# EAGLE design SparkFun_AS3935_Lightning_Detector (EAGLE 9.4.0)
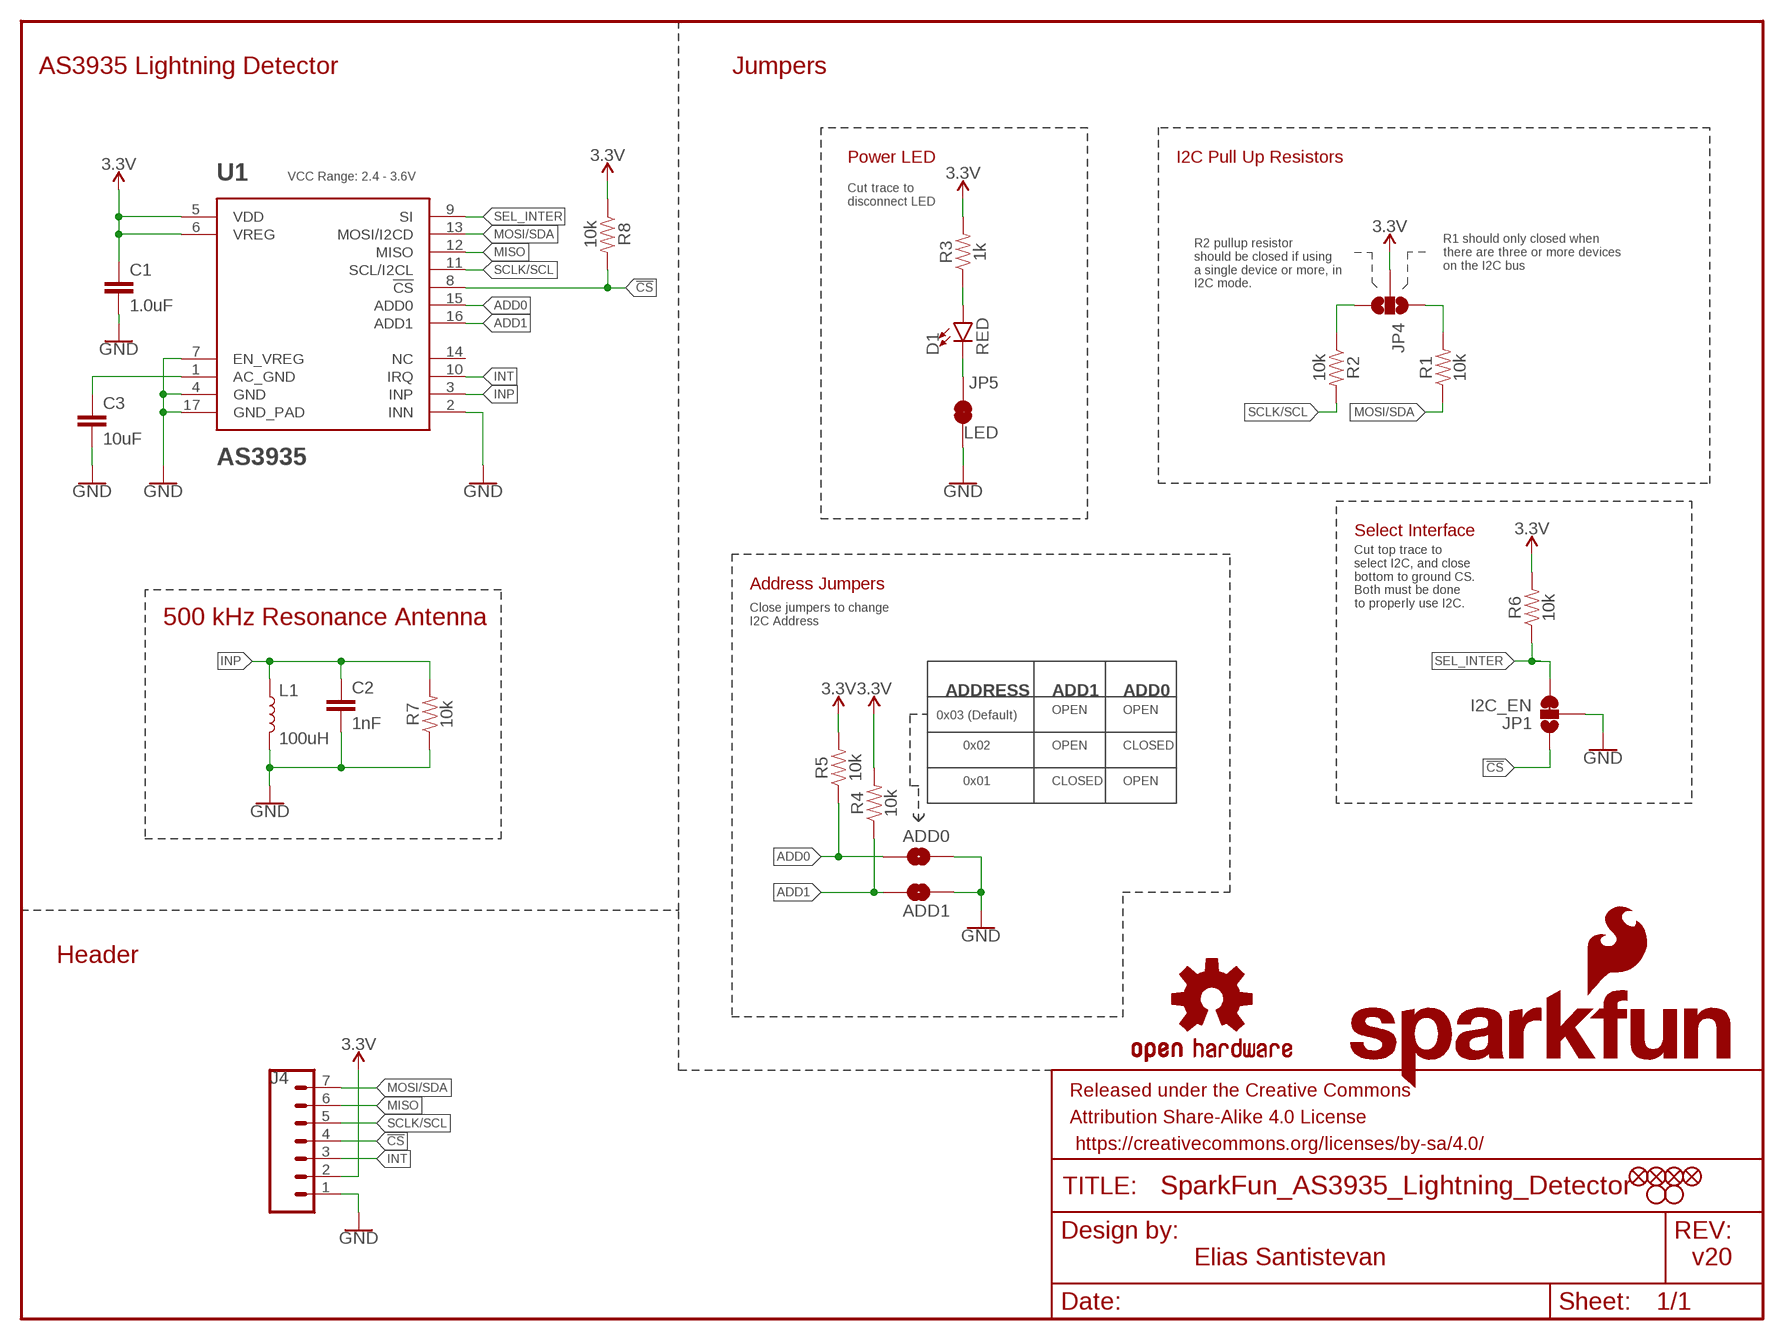
[diagram p0: schematic, sheet 1]

## Parts
ADD0  JUMPER-SMT_2_NO_SILK  [SMT-JUMPER_2_NO_SILK]
ADD1  JUMPER-SMT_2_NO_SILK  [SMT-JUMPER_2_NO_SILK]
C1  1.0uF  1.0UF-0603-16V-10%  [0603]
C2  1nF  1.0NF/1000PF-0603-50V-10%  [0603]
C3  10uF  10UF-0603-6.3V-20%  [0603]
D1  RED  LED-RED0603  [LED-0603]
FD1  FIDUCIAL1X2  [FIDUCIAL-1X2]
FD2  FIDUCIAL1X2  [FIDUCIAL-1X2]
FD3  FIDUCIAL1X2  [FIDUCIAL-1X2]
FD4  FIDUCIAL1X2  [FIDUCIAL-1X2]
FRAME1  FRAME-LETTER  [CREATIVE_COMMONS]
H1  STAND-OFFTIGHT  [STAND-OFF-TIGHT]
H2  STAND-OFFTIGHT  [STAND-OFF-TIGHT]
J4  CONN_07NO_SILK  [1X07_NO_SILK]
JP1  I2C_EN  JUMPER-SMT_3_1-NC_TRACE_SILK  [SMT-JUMPER_3_1-NC_TRACE_SILK]
JP4  JUMPER-SMT_3_NO_SILK  [SMT-JUMPER_3_NO_SILK]
JP5  LED  JUMPER-SMT_2_NC_TRACE_SILK  [SMT-JUMPER_2_NC_TRACE_SILK]
L1  100uH  MA5532-AE  [MA5532-AE]
LOGO1  OSHW-LOGOS  [OSHW-LOGO-S]
LOGO2  SFE_LOGO_NAME.1_INCH  [SFE_LOGO_NAME_.1]
LOGO3  SFE_LOGO_FLAME.2_INCH  [SFE_LOGO_FLAME_.2]
R1  10k  10KOHM-0603-1/10W-1%  [0603]
R2  10k  10KOHM-0603-1/10W-1%  [0603]
R3  1k  1KOHM-0603-1/10W-1%  [0603]
R4  10k  10KOHM-0603-1/10W-1%  [0603]
R5  10k  10KOHM-0603-1/10W-1%  [0603]
R6  10k  10KOHM-0603-1/10W-1%  [0603]
R7  10k  10KOHM-0603-1/10W-1%  [0603]
R8  10k  10KOHM-0603-1/10W-1%  [0603]
U1  AS3935  AS3935QFN  [16LD_MLPQ]

## Nets
3.3V: C1.1 J4.2 JP4.2 R3.2 R4.2 R5.2 R6.2 R8.1 U1.5(VDD) U1.6(VREG)
!CS: J4.4 JP1.1 R8.2 U1.8(!CS)
ADD0: ADD0.1 R5.1 U1.15(ADD0)
ADD1: ADD1.1 R4.1 U1.16(ADD1)
GND: ADD0.2 ADD1.2 C1.2 C2.2 C3.2 J4.1 JP1.2 JP5.1 L1.2 R7.1 U1.2(INN) U1.4(GND) U1.7(EN_VREG) U1.17(GND_PAD)
INP: C2.1 L1.1 R7.2 U1.3(INP)
INT: J4.3 U1.10(IRQ)
MISO: J4.6 U1.12(MISO)
MOSI/SDA: J4.7 R1.1 U1.13(MOSI/I2CD)
N$1: D1.A R3.1
N$2: C3.1 U1.1(AC_GND)
N$3: JP4.1 R1.2
N$4: JP4.3 R2.1
N$5: D1.C JP5.2
SCLK/SCL: J4.5 R2.2 U1.11(SCL/I2CL)
SEL_INTER: JP1.3 R6.1 U1.9(SI)
Unconnected: U1.14(NC)

## Notes on the sheet
- AS3935 Lightning Detector | Jumpers
- Power LED | I2C Pull Up Resistors
- VCC Range: 2.4 - 3.6V
- Cut trace to 
  disconnect LED
- R1 should only closed when
  there are three or more devices
  on the I2C bus
- R2 pullup resistor
  should be closed if using
  a single device or more, in
  I2C mode.
- Select Interface
- Address Jumpers
- Cut top trace to
  select I2C, and close
  bottom to ground CS.
  Both must be done
  to properly use I2C.
- 500 kHz Resonance Antenna
- Close jumpers to change 
  I2C Address
- ADDRESS | ADD1 | ADD0
- OPEN | OPEN
- 0x03 (Default)
- 0x02 | OPEN | CLOSED
- 0x01 | CLOSED | OPEN
- Header
- Elias Santistevan | v20

## Library data of the parts
ADD0 ADD1 = SparkFun-Jumpers:JUMPER-SMT_2_NO: Normally open jumper This jumper has two pads in close proximity to each other. Apply solder to close the connection. Round pads are easier to solder for beginners, but are a lot larger. SparkFun Product that uses the round pads: SparkFun EL Sequencer <https://www.sparkfun.com/products/12781>
C1 = SparkFun-Capacitors:1.0UF: 1µF ceramic capacitors A capacitor is a passive two-terminal electrical component used to store electrical energy temporarily in an electric field.; PROD_ID: CAP-00868
C2 = SparkFun-Capacitors:1.0NF/1000PF: 1nF/1,000pF ceramic capacitors A capacitor is a passive two-terminal electrical component used to store electrical energy temporarily in an electric field.; PROD_ID: CAP-07886
C3 = SparkFun-Capacitors:10UF: 10.0µF ceramic capacitors A capacitor is a passive two-terminal electrical component used to store electrical energy temporarily in an electric field.; PROD_ID: CAP-11015
D1 = SparkFun-LED:LED-RED: Red SMD LED Used in manufacturing of most products at SparkFun Packages: 0603 - SMD 0603 package [Product Link] <http://docs.avagotech.com/docs/AV02-0551EN> 0603 SMART - SMD 0603 SMART package ( more efficient and expensive)[Product Link] <http://www.osram-os.com/Graphics/XPic2/00077099_0.pdf> 1206 - SMD1206 package [Product Link] <https://www.sparkfun.com/datasheets/DevTools/LilyPad/Q150OVS4.pdff> SparkFun Products: Pro Mini 328 -5V <https://www.sparkfun.com/products/821> RedBoard <https://www.sparkfun.com/products/12757> IOIO-OTG <https://www.sparkfun.com/products/13613>; PROD_ID: DIO-00819
FD1-FD4 = SparkFun-Aesthetics:FIDUCIAL: Fiducial Alignment Points Point-of-reference for pick-and-place machines and other optical instruments.
FRAME1 = SparkFun-Aesthetics:FRAME-LETTER: Schematic Frame - Letter Standard 8.5x11 US Letter frame
H1 H2 = SparkFun-Hardware:STAND-OFF: Stand Off Drill holes for mechanically mounting via screws, standoffs, etc. Note: Use the keepout ring to avoid running the screw head into surrounding components. Variant Overviews STAND-OFF - Mechanical footprint for a #4 phillips button head screw. STAND-OFF-TIGHT - Mechanical footprint for a #4 phillips button head screw, Example SparkFun Products Screw - Phillips Head (1/4", 4-40, 10 pack) <https://www.sparkfun.com/products/10453> (PRT-10453) Screw - Phillips Head (1/2", 4-40, 10 pack) <https://www.sparkfun.com/products/10452> (PRT-10452) Screw - Phillips Head (3/4", 4-40, 10 pack) <https://www.sparkfun.com/products/10451> (PRT-10451) Screw - Phillips Head (1", 4-40, 10 pack) <https://www.sparkfun.com/products/10450> (PRT-10450)
J4 = SparkFun-Connectors:CONN_07: Multi connection point. Often used as Generic Header-pin footprint for 0.1 inch spaced/style header connections On any of the 0.1 inch spaced packages, you can populate with these: Break Away Headers - Straight <https://www.sparkfun.com/products/116> (PRT-00116) Break Away Male Headers - Right Angle <https://www.sparkfun.com/products/553> (PRT-00553) Female Headers <https://www.sparkfun.com/products/115> (PRT-00115) Break Away Headers - Machine Pin <https://www.sparkfun.com/products/117> (PRT-00117) Break Away Female Headers - Swiss Machine Pin <https://www.sparkfun.com/products/743> (PRT-00743) For SCREWTERMINALS and SPRING TERMINALS visit here: Screw Terimnals on SparkFun.com <https://www.sparkfun.com/search/results?term=Screw+Terminals> (5mm/3.5mm/2.54mm spacing) This device is also useful as a general connection point to wire up your design to another part of your project. Our various solder wires solder well into these plated through hole pads. Hook-Up Wire - Assortment (Stranded, 22 AWG) <https://www.sparkfun.com/products/11375> (PRT-11375) Hook-Up Wire - Assortment (Solid Core, 22 AWG) <https://www.sparkfun.com/products/11367> (PRT-11367) View the entire wire category on our website here <https://www.sparkfun.com/categories/141> Special notes: Molex polarized connector foot print use with SKU : PRT-08231 with associated crimp pins and housings. 1MM SMD Version SKU: PRT-10208 NOTES ON THE VARIANTS LOCK and LOCK_LONGPADS... This footprint was designed to help hold the alignment of a through-hole component (i.e. 6-pin header) while soldering it into place. You may notice that each hole has been shifted either up or down by 0.005 of an inch from it's more standard position (which is a perfectly straight line). This slight alteration caused the pins (the squares in the middle) to touch the edges of the holes. Because they are alternating, it causes a "brace" to hold the component in place. 0.005 has proven to be the perfect amount of "off-center" position when using our standard breakaway headers. Although looks a little odd when you look at the bare footprint, once you have a header in there, the alteration is very hard to notice. Also,if you push a header all the way into place, it is covered up entirely on the bottom side.
JP1 = SparkFun-Jumpers:JUMPER-SMT_3_1-NC_TRACE: Normally closed trace jumper (1 of 2 connections) This jumper has a trace between two pads so it's normally closed (NC). The other connection is normally open (NO). Use a razor knife to open the connection. For best results follow the IPC guidelines for cutting traces: Cutout at least 0.063 mm (0.005 in). Remove all loose material to clean up the cut area. Seal the cut with an approved epoxy. Reapply solder to reclose the connection, or to close the NO connection.
JP4 = SparkFun-Jumpers:JUMPER-SMT_3_NO: Normally open jumper This jumper has three pads in close proximity to each other. Apply solder to close the connection(s).
JP5 = SparkFun-Jumpers:JUMPER-SMT_2_NC_TRACE: Normally closed trace jumper This jumper has a trace between two pads so it's normally closed (NC). Use a razor knife to open the connection. For best results follow the IPC guidelines for cutting traces: Cutout at least 0.063 mm (0.005 in). Remove all loose material to clean up the cut area. Seal the cut with an approved epoxy. Reapply solder to reclose the connection.
L1 = SparkFun-Coils:MA5532-AE: RFID Transponder Coil - MA5532-AE; PROD_ID: NDUC-11334
LOGO1 = SparkFun-Aesthetics:OSHW-LOGO: Open-Source Hardware (OSHW) Logo This logo indicates the piece of hardware it is found on incorporates a OSHW license and/or adheres to the definition of open source hardware found here: http://freedomdefined.org/OSHW
LOGO2 = SparkFun-Aesthetics:SFE_LOGO_NAME: SparkFun Font Logo This is the SparkFun name logo. The logo on the schematic will always be the same size; the package variant is the height of the flame part of the logo (or the height the flame would be, if it were drawn). Default layer for the logo on the board is tSilk.
LOGO3 = SparkFun-Aesthetics:SFE_LOGO_FLAME: SparkFun Flame Logo This is the SparkFun flame logo. The logo on the schematic will always be the same size; the package variant is the height of the flame. Default layer for the logo on the board is tSilk.
R1 R2 R4-R8 = SparkFun-Resistors:10KOHM: 10kΩ resistor A resistor is a passive two-terminal electrical component that implements electrical resistance as a circuit element. Resistors act to reduce current flow, and, at the same time, act to lower voltage levels within circuits. - Wikipedia; PROD_ID: RES-00824
R3 = SparkFun-Resistors:1KOHM: 1kΩ resistor A resistor is a passive two-terminal electrical component that implements electrical resistance as a circuit element. Resistors act to reduce current flow, and, at the same time, act to lower voltage levels within circuits. - Wikipedia; PROD_ID: RES-07856
U1 = SparkFun-Sensors:AS3935: AS3935 Franklin Lightning Sensor The AS3935 is a programmable fully integrated Lightning Sensor IC that detects the presence and approach of potentially hazardous lightning activity in the vicinity and provides an estimation on the distance to the head of the storm. The embedded lightning algorithm checks the incoming signal pattern to reject the potential man-made disturbers.The AS3935 can also provide information on the noise level and inform the external unit (e.g. microcontroller) in case of high noise conditions, with the noise floor generator and noise floor evaluation blocks.; PROD_ID: IC-11333

## Board
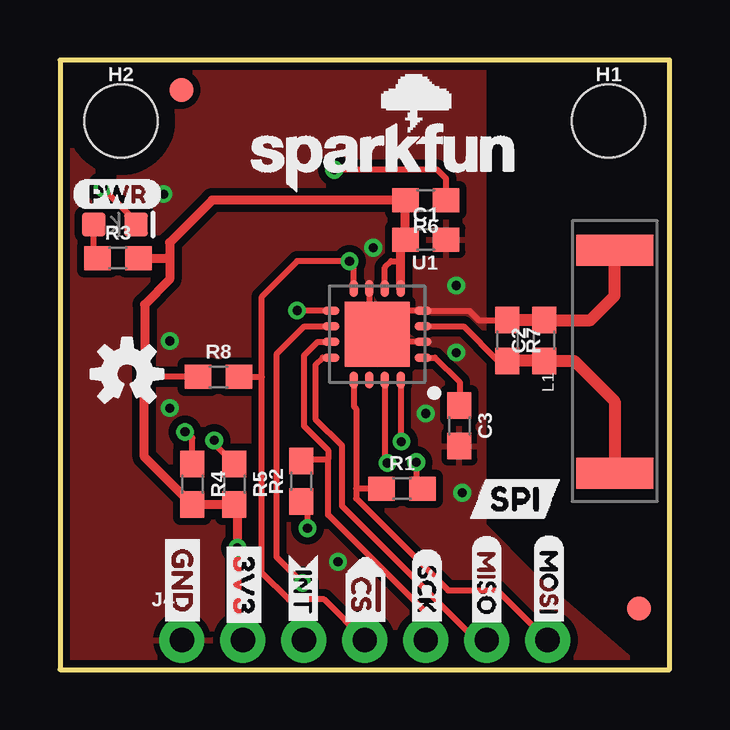
[diagram p1: board, top side]
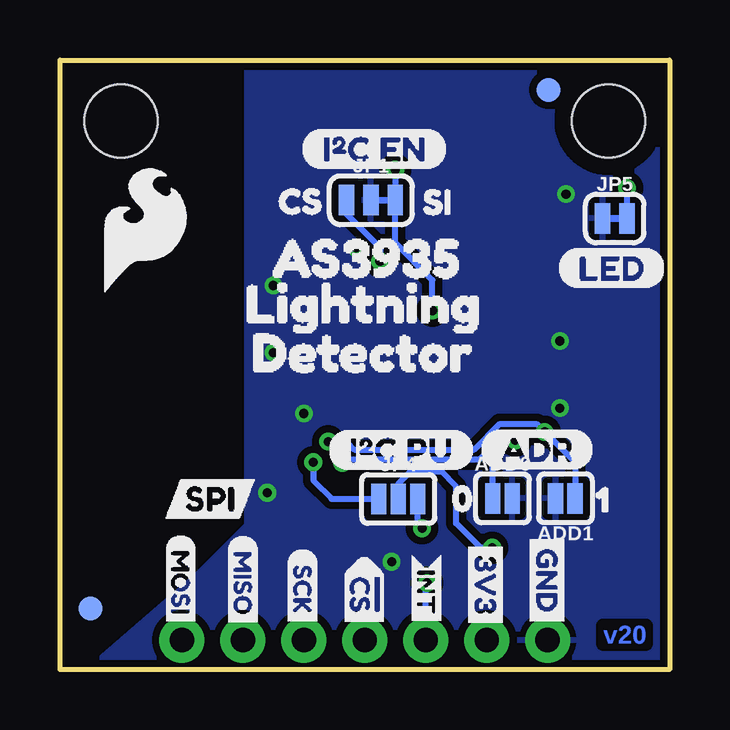
[diagram p2: board, bottom side, seen from below]

Size 25.4 x 25.4 mm. Coordinates in mm from the lower left corner, seen from the top.
Outline: 0,0 25.4,0 25.4,25.4 0,25.4 0,0
Copper layers (1*16): Top 0.035mm / dielectric 1.5mm / Bottom 0.035mm
Design rules "SparkFun-2-layer-TIGHT": minimum track width 7mil, minimum drill 15mil, track to track 7mil, track to pad 7mil, pad to pad 7mil, via to via 7mil, smd to smd 7mil, copper to edge 7mil, drill to drill 7mil, minimum pad ring 7mil, minimum via ring 7mil, stop-mask expansion 4mil, vias tented up to drill 25mil, thermal gap 10mil

### Footprints (pad centres in the part's own frame; a part is rotated, then mirrored left to right if it is on the bottom)
SMT-JUMPER_2_NO_SILK = smd 0.635 x 1.27: 1 -0.406,0; 2 0.406,0
0603 = smd 1.1 x 1: 1 -0.85,0; 2 0.85,0
LED-0603 = smd 1 x 1: A -0.877,0; C 0.877,0
FIDUCIAL-1X2 = smd 1 x 1: 1 0,0
STAND-OFF-TIGHT = hole 3.048: 0,0
1X07_NO_SILK = drill 1.016 pad 1.88: 1 0,0; 2 2.54,0; 3 5.08,0; 4 7.62,0; 5 10.16,0; 6 12.7,0; 7 15.24,0
SMT-JUMPER_3_1-NC_TRACE_SILK = smd 0.635 x 1.27: 1 -1.016,0; 2 0,0; 3 1.016,0
SMT-JUMPER_3_NO_SILK = smd 0.635 x 1.27: 1 -0.813,0; 2 0,0; 3 0.813,0
SMT-JUMPER_2_NC_TRACE_SILK = smd 0.635 x 1.27: 1 -0.508,0; 2 0.508,0
MA5532-AE = smd 1.3 x 3.2: 1 -4.65,0; 2 4.65,0
16LD_MLPQ = smd 0.7 x 0.35: 1 -1.919,0.968; 2 -1.919,0.318; 3 -1.919,-0.332; 4 -1.919,-0.982; 9 1.908,-0.982; 10 1.908,-0.332; 11 1.908,0.318; 12 1.908,0.968 | smd 0.35 x 0.7: 5 -0.982,-1.917; 6 -0.332,-1.917; 7 0.318,-1.917; 8 0.968,-1.917; 13 0.968,1.907; 14 0.318,1.907; 15 -0.332,1.907; 16 -0.982,1.907 | smd 2.7 x 2.7: 17 -0.007,-0.007

### Placement (x,y rotation side)
ADD0  6.96,7.14 0 bottom
ADD1  4.34,7.14 180 bottom
C1  15.24,17.91 0 top
C2  20.17,13.72 90 top
C3  16.64,10.16 270 top
D1  2.29,18.54 0 top
FD1  5.05,24.16 0 bottom
FD2  24.13,2.54 0 bottom
FD3  24.13,2.54 0 top
FD4  5.05,24.16 0 top
FRAME1  -7.62,-19.05 0 top  (outside the outline)
H1  22.86,22.86 0 top
H2  2.54,22.86 0 top
J4  5.08,1.23 0 top
JP1  12.45,19.56 0 bottom
JP4  11.3,7.11 0 bottom
JP5  2.29,18.8 0 bottom
L1  23.11,12.83 90 top
LOGO1  2.79,12.32 0 top
LOGO2  13.46,21.34 0 top
LOGO3  21.84,18.29 0 bottom
R1  14.25,7.54 0 top
R2  10.06,7.85 90 top
R3  2.41,17.14 0 top
R4  5.51,7.72 270 top
R5  7.26,7.72 270 top
R6  15.24,19.56 180 top
R7  18.64,13.72 270 top
R8  6.6,12.19 0 top
U1  13.21,13.97 180 top
U$1  [LED0]  4.71,16.73 0 bottom
U$2  [GND-03]  5.11,5.84 270 bottom
U$3  [SPI1]  17.02,7.11 0 top
U$4  [3V3-03]  7.67,5.59 270 bottom
U$5  [#CS0]  12.73,4.95 270 bottom
U$6  [AS39350]  17.91,17.14 0 bottom
U$7  [LIGHTNING0]  19.05,15.24 0 bottom
U$8  [SCK-(]-03]  15.29,5.05 270 bottom
U$9  [MISO-(]-03]  17.78,5.64 270 bottom
U$10  [GND-03]  5.11,5.84 270 top
U$11  [MOSI-(]-03]  20.37,5.66 270 bottom
U$12  [MISO-(]-03]  17.78,5.64 270 top
U$13  [INT0]  10.13,4.85 270 top
U$14  [INT0]  10.13,4.85 270 bottom
U$15  [SPI1]  21.08,7.11 0 bottom
U$16  [CS0]  17.22,19.51 0 bottom
U$17  [I#C_EN0]  15.37,21.69 0 bottom
U$18  [3V3-03]  7.67,5.59 270 top
U$19  [SI1]  11.18,19.48 0 bottom
U$22  [MOSI-(]-03]  20.37,5.66 270 top
U$23  [SCK-(]-03]  15.29,5.05 270 top
U$30  [#CS0]  12.73,4.95 270 top
U$32  [PWR-()-03]  0.51,19.81 0 top
U$33  [ADR-()-04]  7.95,9.17 0 bottom
U$34  [I#C_PU0]  14.25,9.14 0 bottom
U$36  [10]  3.99,7.09 0 bottom
U$37  [00]  9.98,7.14 0 bottom
U$39  [DETECTOR0]  18.8,13.21 0 bottom
U$40  [##0]  10.79,23.75 0 top

### Tracks (layer width: path | path; a pad name or v marks a point on that pad's centre or on a via)
3.3V  (via drill 0.38)
  Top 0.254: U1.6 13.54,16.76 13.79,17.02 14.19,17.02 | R8.1 3.52,12.19
  Top 0.381: U1.5 14.19,17.02 14.19,17.71 C1.1 R6.2 6.34,19.56 4.57,17.79 4.57,17.02 | J4.2 7.39,1.46 v7.39,5.08 7.39,6.75 R5.2 R4.2 3.52,8.87 3.52,12.19 3.52,13.21 3.52,13.2 3.52,15.21 4.57,16.26 4.57,17.02 | R3.2 4.45,17.14 4.57,17.02
  Bottom 0.254: JP4.2 11.3,7.75 10.79,8.26 9.53,8.26 8.89,7.62 8.89,6.1 7.87,5.08 v7.39,5.08
!CS  (via drill 0.38)
  Top 0.254: J4.4 11.01,2.92 9.53,2.92 8.41,4.04 8.41,12.19 | R8.2 8.41,12.19 | U1.8 12.24,16.84 v12.06,17.02 9.88,17.02 8.41,15.54 8.41,12.19
  Bottom 0.254: JP1.1 13.46,18.97 12.06,17.58 v12.06,17.02
ADD0  (via drill 0.38)
  Top 0.254: U1.15 13.54,8.51 v13.64,8.61 | v6.43,9.55 6.43,9.41 R5.1
  Bottom 0.254: v13.64,8.61 13.51,8.74 7.95,8.74 7.58,9.11 | 7.58,9.11 7.14,9.55 v6.43,9.55 | ADD0.1 7.37,8.89 7.58,9.11
ADD1  (via drill 0.38)
  Top 0.254: U1.16 14.19,9.53 v14.22,9.5 | R4.1 5.51,9.65 5.26,9.91 v5.21,9.91
  Bottom 0.254: ADD1.1 3.94,8.64 v5.21,9.91 5.54,10.24 7.07,10.24 8.14,9.17 13.13,9.17 13.46,9.5 v14.22,9.5
GND  (via drill 0.38)
  Top 0.254: U1.2 14.22,13.65 | 14.22,14.95 U1.4 17.05,14.95 17.44,14.57 R7.1 | U1.7 12.89,14.3 U1.17
  Top 0.508: R7.1 C2.2 22.1,14.57 23.11,15.58 L1.2
  other vias: 16.76,7.37 16.51,13.21 16.51,16 13.06,17.58 4.32,19.81 4.57,13.69 15.24,10.67 11.58,4.5 4.57,10.9
  pour Top (isolate 0.305): 24.25,0 0,0 0,25.4 17.63,25.4 17.63,6.02 19.75,3.9
  pour Bottom (isolate 0.305): 0,25.4 17.63,25.4 17.63,6.02 19.75,3.9 24.25,0 0,0
INP
  Top 0.254: U1.3 16.81,14.3 18.25,12.87 R7.2
  Top 0.508: R7.2 C2.1 21.42,12.87 23.11,11.18 L1.1
INT  (via drill 0.38)
  Top 0.254: v10.11,3.61 9.02,4.7 9.02,13.13 10.19,14.3 U1.10
  Bottom 0.254: J4.3 10.16,3.66 v10.11,3.61
MISO
  Top 0.254: J4.6 17.34,1.23 11.76,6.81 11.76,9.32 10.64,10.44 10.64,12.7 10.94,13 U1.12
MOSI/SDA
  Top 0.254: 12.34,7.54 12.34,10.87 12.24,10.97 U1.13 | R1.1 12.34,7.54 | J4.7 20.3,1.23 18.22,3.3 16.18,3.3 12.34,7.14 12.34,7.54
N$1
  Top 0.254: R3.1 1.41,17.3 D1.A
N$2
  Top 0.254: U1.1 15.63,13 16.65,11.99 16.65,11.02 C3.1
N$3  (via drill 0.38)
  Top 0.254: v14.85,8.64 14.85,7.8 R1.2
  Bottom 0.254: v14.85,8.64 14.85,7.87 14.08,7.11 JP4.1
N$4  (via drill 0.38)
  Top 0.254: R2.1 10.31,6.75 v10.31,5.89
  Bottom 0.254: v10.31,5.89 10.49,6.07 JP4.3
N$5  (via drill 0.38)
  Top 0.254: D1.C 3.16,18.68 v1.78,20.07
  Bottom 0.254: v1.78,20.07 JP5.2
SCLK/SCL
  Top 0.254: U1.11 10.73,13.65 10.16,13.08 10.16,10.16 11.18,9.14 11.18,8.76 | 11.18,8.76 11.18,6.45 15.24,2.39 J4.5 | R2.2 10.12,8.76 11.18,8.76
SEL_INTER  (via drill 0.38)
  Top 0.254: U1.9 v9.89,14.95 v9.88,14.96 | R6.1 16.09,20.45 15.71,20.83 v11.43,20.83
  Bottom 0.254: v9.88,14.96 9.88,16.23 11.43,17.78 JP1.3 v11.43,20.83

### Text on the board
Bottom: v20
Measures: Units in Inches
tDocu: Elias Santistevan